# Altium schematic sheet 01_Overview.SchDoc
size A4; SheetNumber: 2; SheetTotal: 6
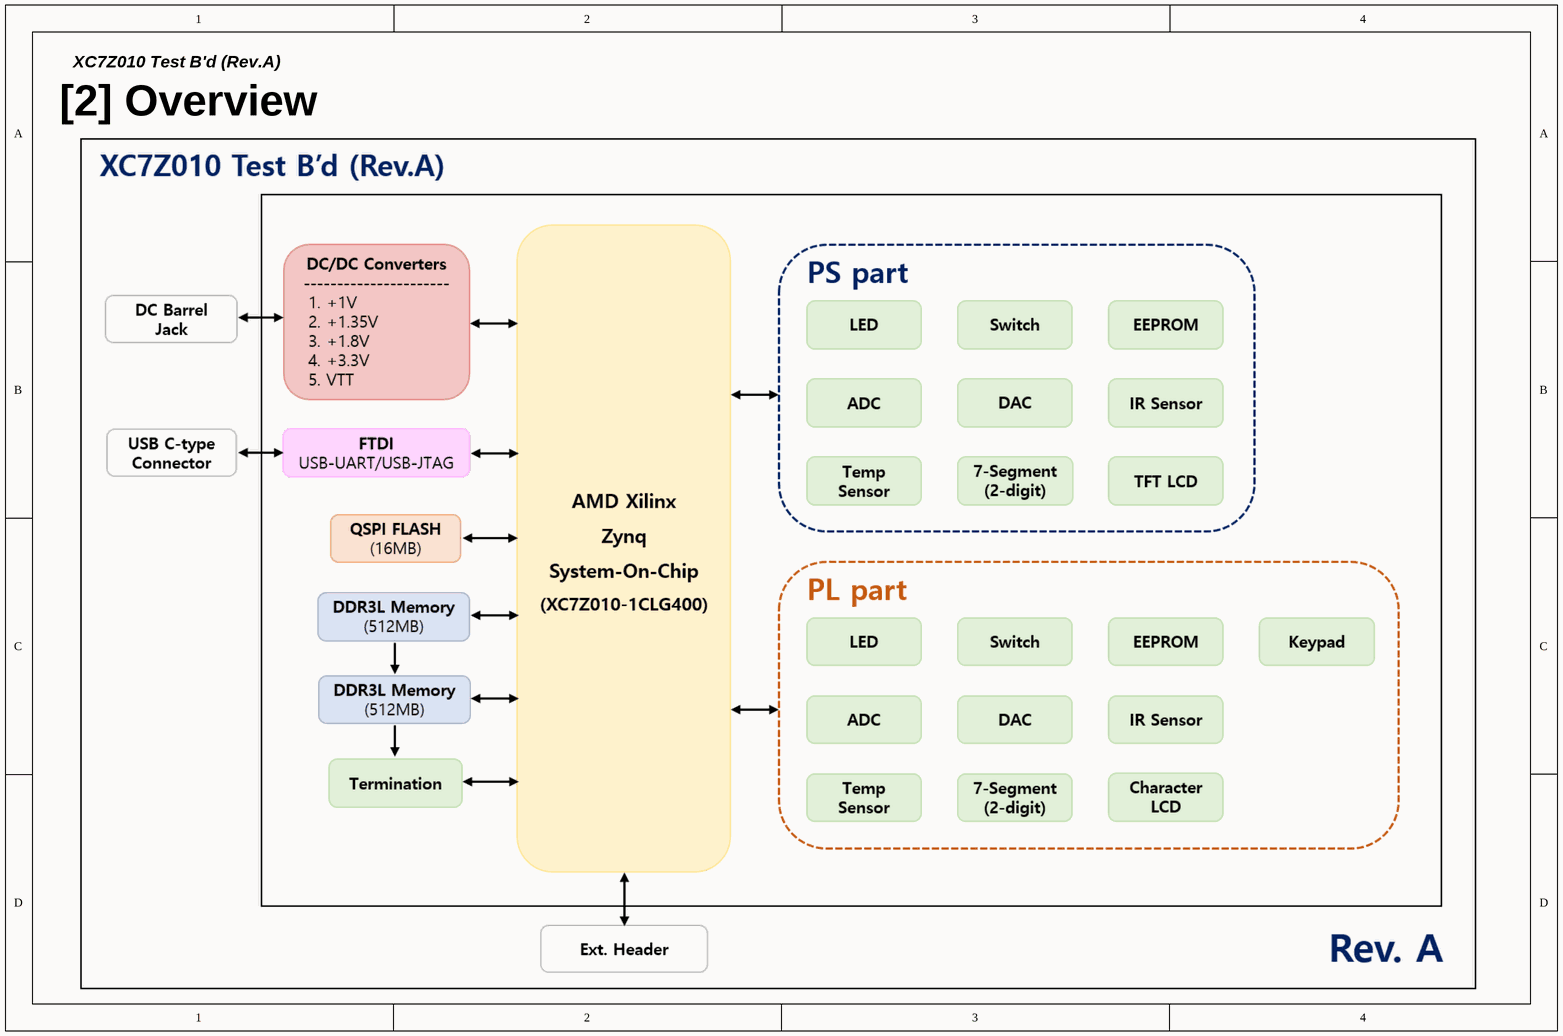
[diagram p0: 01_Overview.SchDoc]

## Notes on the sheet
- XC7Z010 Test B'd (Rev.A)
- [2] Overview